# Altium schematic sheet micro.SchDoc
size A4
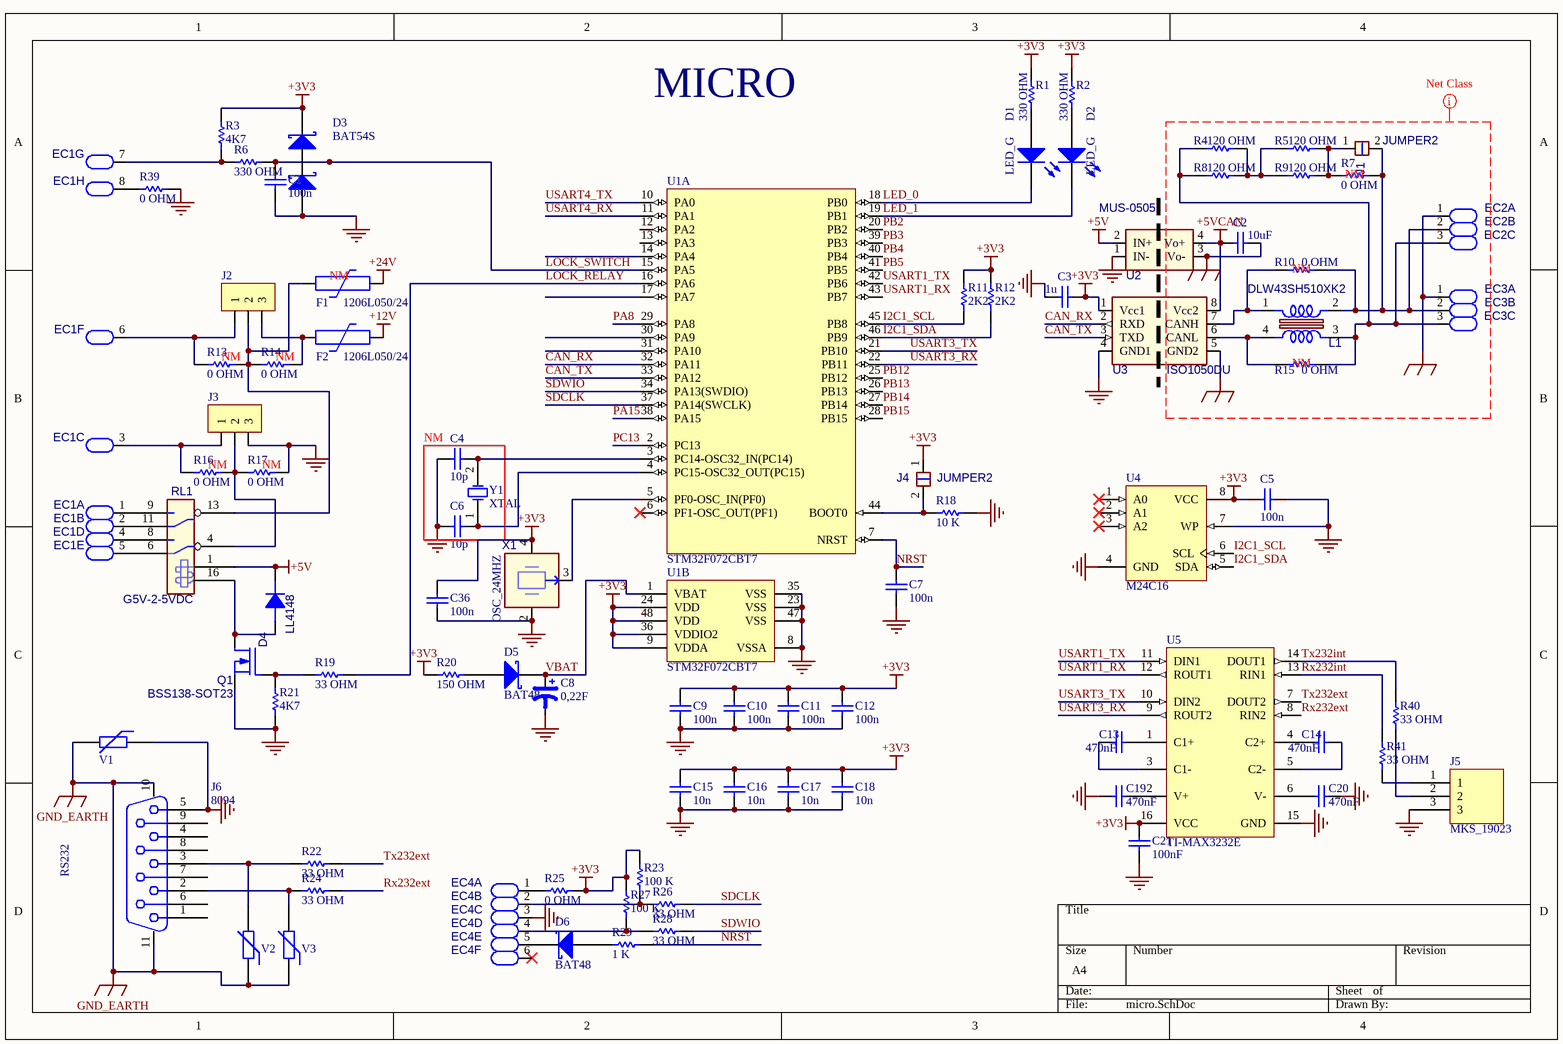
[diagram p0: micro.SchDoc]

## Parts
C1  100n  [0603]
C2  10uF  [0805]
C3  1u  [0603]
C4  10p  [0603]
C5  100n  [0603]
C6  10p  [0603]
C7  100n  [0603]
C8  0,22F  [EECRG0V224V]
C9  100n  [0603]
C10  100n  [0603]
C11  100n  [0603]
C12  100n  [0603]
C13  470nF  [0805]
C14  470nF  [0805]
C15  10n  [0603]
C16  10n  [0603]
C17  10n  [0603]
C18  10n  [0603]
C19  470nF  [0805]
C20  470nF  [0805]
C21  100nF  [0805]
C36  100n  [0603]
D1  LED_G  [LED0603G]
D2  LED_G  [LED0603G]
D3  BAT54S  [SOT23]
D4  LL4148  [SOD123]
D5  BAT48  [0805]
D6  BAT48  [0805]
EC1  JST_XAD_8  [JST_XADSS_8]  (value not drawn)  (parts A,B,C,D,E,F,G,H of 8)
EC2  Conexcon-2545-2-03-1_1  [CONEXCON-2545-2-03-1]  (value not drawn)  (parts A,B,C of 3)
EC3  Conexcon-2545-2-03-1_1  [CONEXCON-2545-2-03-1]  (value not drawn)  (parts A,B,C of 3)
EC4  Conexcon-2545-2-06-1  [CONEXCON-2545-2-06-1]  (value not drawn)  (parts A,B,C,D,E,F of 6)
F1  1206L050/24  [POLYFUSE_1206L]
F2  1206L050/24  [POLYFUSE_1206L]
J1  JUMPER2  [JUMPER_2X1_2.54]
J2  Header 3  [HDR1X3]  (value not drawn)
J3  Header 3  [HDR1X3]  (value not drawn)
J4  JUMPER2  [JUMPER_2X1_2.54]
J5  MKS_19023  [MOLEX_MKS_19023]
J6  8094  [8094]
L1  DLW43SH510XK2  [1812_DLW]
Q1  BSS138-SOT23  [SOT23 - RJ]
R1  330 OHM  [R0603]
R2  330 OHM  [R0603]
R3  4K7  [R0603]
R4  120 OHM  [R0603]
R5  120 OHM  [R0603]
R6  330 OHM  [R0603]
R7  0 OHM  [R0603]
R8  120 OHM  [R0603]
R9  120 OHM  [R0603]
R10  0 OHM  [R0603]
R11  2K2  [R0603]
R12  2K2  [R0603]
R13  0 OHM  [R0805]
R14  0 OHM  [R0805]
R15  0 OHM  [R0603]
R16  0 OHM  [R0805]
R17  0 OHM  [R0805]
R18  10 K  [R0603]
R19  33 OHM  [R0603]
R20  150 OHM  [R0603]
R21  4K7  [R0603]
R22  33 OHM  [R0603]
R23  100 K  [R0603]
R24  33 OHM  [R0603]
R25  0 OHM  [R0603]
R26  33 OHM  [R0603]
R27  100 K  [R0603]
R28  33 OHM  [R0603]
R29  1 K  [R0603]
R39  0 OHM  [R0603]
R40  33 OHM  [R0603]
R41  33 OHM  [R0603]
RL1  G5V-2-5VDC  [RL-OMRON-G5V-2-5VDC]
U1  STM32F072CBT7  [STM-LQFP48_N_3d]  (parts A,B of 2)
U2  MUS-0505  [MUS-0505]
U3  ISO1050DU  [DUB_R_PDSO_G8]
U4  M24C16  [SO08]
U5  TI-MAX3232E  [SOIC16]
V1  VC080526C580  [VC080526C580]  (value not drawn)
V2  VC080526C580  [VC080526C580]  (value not drawn)
V3  VC080526C580  [VC080526C580]  (value not drawn)
X1  OSC_24MHZ  [Oscillator_7x5]
Y1  XTAL  [R38]

## Blocks framed on the sheet
NM: C4 C6 Y1

## Nets
+3V3: C3.1 C5.2 C9.2 C10.2 C11.2 C12.2 C15.2 C16.2 C17.2 C18.2 C21.1 C36.2 D3.2(K) J4.1 R1.2 R2.2 R3.2 R11.1 R12.1 R20.1 R23.2 R25.1 R27.2 U1.9(VDDA) U1.24(VDD) U1.36(VDDIO2) U1.48(VDD) U3.1(Vcc1) U4.8(VCC) U5.16(VCC) X1.4
+5V: D4.2(K) RL1.1(COIL1) U2.2(IN+)
+5VCAN: C2.1 U2.4(Vo+) U3.8(Vcc2)
+12V: F2.2
+24V: F1.2
GND: C1.1 C3.2 C4.1 C5.1 C6.1 C7.1 C8.2 C9.1 C10.1 C11.1 C12.1 C15.1 C16.1 C17.1 C18.1 C19.1 C20.2 C21.2 C36.1 D3.1(A) EC4.3 J3.3 J5.3 J6.5 Q1.S R17.1 R18.1 R21.1 R39.1 U1.8(VSSA) U1.23(VSS) U1.35(VSS) U1.47(VSS) U2.1(IN-) U3.4(GND1) U4.4(GND) U4.7(WP) U5.15(GND) V1.1 X1.2
GND_CAN: C2.2 EC2.1 EC3.1 U2.3(Vo-) U3.5(GND2)
GND_EARTH: J6.10 J6.11 V1.2 V2.1 V3.1
CAN_RX: U1.32(PA11) U3.2(RXD)
CAN_TX: U1.33(PA12) U3.3(TXD)
I2C1_SCL: R11.2 U1.45(PB8) U4.6(SCL)
I2C1_SDA: R12.2 U1.46(PB9) U4.5(SDA)
LED_0: D1.2(K) U1.18(PB0)
LED_1: D2.2(K) U1.19(PB1)
LOCK_RELAY: R19.2 U1.16(PA6)
LOCK_SWITCH: C1.2 D3.3(KA) R6.1 U1.15(PA5)
NRST: C7.2 R29.2 U1.7(NRST)
PA8: U1.29(PA8)
PA15: U1.38(PA15)
PB2: U1.20(PB2)
PB3: U1.39(PB3)
PB4: U1.40(PB4)
PB5: U1.41(PB5)
PB12: U1.25(PB12)
PB13: U1.26(PB13)
PB14: U1.27(PB14)
PB15: U1.28(PB15)
PC13: U1.2(PC13)
Rx232ext: R24.2 U5.8(RIN2)
Rx232int: R41.2 U5.13(RIN1)
SDCLK: R26.2 U1.37(PA14(SWCLK))
SDWIO: R28.2 U1.34(PA13(SWDIO))
Tx232ext: R22.2 U5.7(DOUT2)
Tx232int: R40.2 U5.14(DOUT1)
USART1_RX: U1.43(PB7) U5.12(ROUT1)
USART1_TX: U1.42(PB6) U5.11(DIN1)
USART3_RX: U1.22(PB11) U5.9(ROUT2)
USART3_TX: U1.21(PB10) U5.10(DIN2)
USART4_RX: U1.11(PA1)
USART4_TX: U1.10(PA0)
VBAT: C8.1 D5.2(K) U1.1(VBAT)
NetC4_2: C4.2 U1.3(PC14-OSC32_IN(PC14)) Y1.2(OSC2)
NetC6_2: C6.2 U1.4(PC15-OSC32_OUT(PC15)) Y1.1(OSC1)
NetC13_1: C13.1 U5.3(C1-)
NetC13_2: C13.2 U5.1(C1+)
NetC14_1: C14.1 U5.4(C2+)
NetC14_2: C14.2 U5.5(C2-)
NetC19_2: C19.2 U5.2(V+)
NetC20_1: C20.1 U5.6(V-)
NetD1_1: D1.1(A) R1.1
NetD2_1: D2.1(A) R2.1
NetD4_1: D4.1(A) Q1.D RL1.16(COIL2)
NetD5_1: D5.1(A) R20.2
NetD6_1: D6.1(A) R29.1
NetD6_2: D6.2(K) EC4.5
NetEC1_1: EC1.1 RL1.9(NO)
NetEC1_2: EC1.2 RL1.11(NO)
NetEC1_3: EC1.3 J3.1 R16.2
NetEC1_4: EC1.4 RL1.8(NO)
NetEC1_5: EC1.5 RL1.6(NO)
NetEC1_6: EC1.6 J2.1 R13.2
NetEC1_7: EC1.7 R3.1 R6.2
NetEC1_8: EC1.8 R39.2
NetEC2_2: EC2.2 EC3.2 J1.2 L1.2 R7.2 R10.2
NetEC2_3: EC2.3 EC3.3 L1.3 R4.1 R8.1 R15.2
NetEC4_1: EC4.1 R25.2
NetEC4_2: EC4.2 R23.1 R26.1
NetEC4_4: EC4.4 R27.1 R28.1
NetF1_1: F1.1 J2.2 R13.1 R14.2 RL1.13(COMMON)
NetF2_1: F2.1 J2.3 R14.1
NetJ1_1: J1.1 R5.2 R7.1 R9.2
NetJ3_2: J3.2 R16.1 R17.2 RL1.4(COMMON)
NetJ4_2: J4.2 R18.2 U1.44(BOOT0)
NetJ5_1: J5.1 R41.1
NetJ5_2: J5.2 R40.1
NetJ6_2: J6.2 R24.1 V3.2
NetJ6_3: J6.3 R22.1 V2.2
NetL1_1: L1.1 R10.1 U3.7(CANH)
NetL1_4: L1.4 R15.1 U3.6(CANL)
NetQ1_G: Q1.G R19.1 R21.2
NetR4_2: R4.2 R5.1 R8.2 R9.1
NetU1_5: U1.5(PF0-OSC_IN(PF0)) X1.3

Not connected (* = marked no-connect by the designer): EC4 6*; J6 1 4 6 7 8 9; U1 6(PF1-OSC_OUT(PF1))* 12(PA2) 13(PA3) 14(PA4) 17(PA7) 30(PA9) 31(PA10); U4 1(A0)* 2(A1)* 3(A2)*

## Layout directives
net class EXT_CAN: +5VCAN, GND_CAN

## Notes on the sheet
- MICRO
- (near R7) NM
- (near F1) NM
- (near R10) NM
- (near R13) NM
- (near R14) NM
- (near R15) NM
- (near R16) NM
- (near R17) NM
- RS232

## Library data of the parts
C1 C5 C7 C9-C12 C36 = 6003071: Capacitor; Value: 100pF; DescripcionArticulo: COND. CERAMICO SMD 0603 100 NF X7R 50V 10%; tipo: condensador; Published: 8-Jun-2000; LatestRevisionDate: 17-Jul-2002; LatestRevisionNote: Re-released for DXP Platform.; PackageReference: RAD-0.3; Publisher: Altium Limited; PackageDescription: Radial Cap, Thru-Hole; 2 Leads; 0.3 in Pin Spacing; Codigo: 6003071; valor: 100n
C2 = 6003114: Capacitor; Value: 100pF; DescripcionArticulo: COND. CERAMICO SMD 0805 10 UF 6.3V -10V; tipo: condensador; Published: 8-Jun-2000; LatestRevisionDate: 17-Jul-2002; LatestRevisionNote: Re-released for DXP Platform.; PackageReference: RAD-0.3; Publisher: Altium Limited; PackageDescription: Radial Cap, Thru-Hole; 2 Leads; 0.3 in Pin Spacing; Codigo: 6003114; valor: 10uF
C3 = 6003088: Capacitor; Value: 100pF; DescripcionArticulo: COND. CERAMICO SMD 0603 1 UF X5R 10V 10%; tipo: condensador; Published: 8-Jun-2000; LatestRevisionDate: 17-Jul-2002; LatestRevisionNote: Re-released for DXP Platform.; PackageReference: RAD-0.3; Publisher: Altium Limited; PackageDescription: Radial Cap, Thru-Hole; 2 Leads; 0.3 in Pin Spacing; Codigo: 6003088; valor: 1u
C4 C6 = 6003068: Capacitor; Value: 100pF; DescripcionArticulo: COND. CERAMICO SMD 0603 10 PF X7R 50V; tipo: condensador; Published: 8-Jun-2000; LatestRevisionDate: 17-Jul-2002; LatestRevisionNote: Re-released for DXP Platform.; PackageReference: RAD-0.3; Publisher: Altium Limited; PackageDescription: Radial Cap, Thru-Hole; 2 Leads; 0.3 in Pin Spacing; Codigo: 6003068; valor: 10p
C8 = 3023047: Polarized Capacitor (Axial); DescripcionArticulo: CONDENSADOR EECS0HD224V 0,22F 5,5 V; tipo: condensador; Published: 8-Jun-2000; LatestRevisionDate: 17-Jul-2002; LatestRevisionNote: Re-released for DXP Platform.; PackageReference: POLAR0.8; Publisher: Altium Limited; PackageDescription: Polarized Capacitor; 2 Leads; Codigo: 3023047; valor: 0,22F
C13 C14 C19 C20 = 6003055: Capacitor; Value: 100pF; DescripcionArticulo: COND. CERAMICO SMD 0805 470NF X7R 50V 10%; tipo: condensador; Published: 8-Jun-2000; LatestRevisionDate: 17-Jul-2002; LatestRevisionNote: Re-released for DXP Platform.; PackageReference: RAD-0.3; Publisher: Altium Limited; PackageDescription: Radial Cap, Thru-Hole; 2 Leads; 0.3 in Pin Spacing; Codigo: 6003055; valor: 470nF
C15-C18 = 6003067: Capacitor; Value: 100pF; DescripcionArticulo: COND. CERAMICO SMD 0603 10 NF X7R 50V 10%; tipo: condensador; Published: 8-Jun-2000; LatestRevisionDate: 17-Jul-2002; LatestRevisionNote: Re-released for DXP Platform.; PackageReference: RAD-0.3; Publisher: Altium Limited; PackageDescription: Radial Cap, Thru-Hole; 2 Leads; 0.3 in Pin Spacing; Codigo: 6003067; valor: 10n
C21 = 6003010: Capacitor; Value: 100pF; DescripcionArticulo: COND. CERAMICO SMD 0805 100 NF 50V 10%; tipo: condensador; Published: 8-Jun-2000; LatestRevisionDate: 17-Jul-2002; LatestRevisionNote: Re-released for DXP Platform.; PackageReference: RAD-0.3; Publisher: Altium Limited; PackageDescription: Radial Cap, Thru-Hole; 2 Leads; 0.3 in Pin Spacing; Codigo: 6003010; valor: 100nF
D1 D2 = 6006022: Typical RED, GREEN, YELLOW, AMBER GaAs LED; DescripcionArticulo: DIODO LED VERDE SML-LX0603GW 1.6X0.8X0.6; Escandallo: Sí; tipo: diodo; Published: 8-Jun-2000; LatestRevisionDate: 17-Jul-2002; LatestRevisionNote: Re-released for DXP Platform.; PackageVersion: Feb-2002; PackageReference: 3.2X1.6X1.1; Publisher: Altium Limited; PackageDescription: SM LED; 2 Flat Leads; Codigo: 6006022; valor: LED_G
D3 = 6006051: High Current Density Surface Mount Schottky Rectifier; DescripcionArticulo: DIODO SMD BAT54S Schottky 30V,200mA VISHAY; Escandallo: Sí; tipo: diodo; Codigo: 6006051; valor: BAT54S
D4 = LL4148_(06006001): DIODE SWITCH,100V,150MA,SOD123; Sallen Ref: 06006001; Codigo: 06006001
D5 D6 = 6006002: Schottky Diode; DescripcionArticulo: DIODO SMD TMMBAT48 SCHORTKY; Escandallo: Sí; tipo: diodo; Published: 8-Jun-2000; LatestRevisionDate: 17-Jul-2002; LatestRevisionNote: Re-released for DXP Platform.; PackageReference: SMB; Publisher: Altium Limited; PackageDescription: DO-214-AA/SMB; 2 C-Bend Leads; Body 5.3 x 3.6 mm, inc. leads (LxW); Code_JEDEC: DO-214-AA; Codigo: 6006002; valor: BAT48
EC1 = Conn_JST_XADSS_8_vias: Conector 8(2x4) vias (3A); Sallen Ref: 05100217; Part Number: -
EC2 EC3 = 5100106: 2.54mm pitch Terminal Block 3P; Sallen Ref: 05100106; DescripcionArticulo: CON.RECTO MACHO 3P SERIE 2545 PASO 2.54; Escandallo: Sí; valor: RECTO3P; tipo: conector; Part Number: Conexcon-2545-2-03-1; Codigo: 5100106
EC4 = 5100107: 2.54mm pitch Terminal Block 6P; Sallen Ref: 05100107; DescripcionArticulo: CON.RECTO MACHO 6P SERIE 2545 PASO 2.54; Escandallo: Sí; valor: RECTO6P; tipo: conector; Part Number: Conexcon-2545-2-06-1; Codigo: 5100107
F1 F2 = POLYFUSE_1206L050/24: www.digikey.com: 507-1803-1-ND
J1 J4 = 5190140: Jumper 2pin P=2.54mm; Sallen Ref: 05190140; DescripcionArticulo: JUMPER PARA POSTE AISLADO- PASO: 2.54MM (CO 3005); Escandallo: Sí; valor: JMP; tipo: conector; Part Number: -; Codigo: 5190140
J2 J3 = 5190120: Header, 3-Pin; DescripcionArticulo: BARRA TIRA POSTE C.I M+M 1X3 RECTA paso 2.54mm; Descripcion2Articulo: Pin Strip Header 1x3; Escandallo: Sí; LatestRevisionDate: 17-Jul-2002; LatestRevisionNote: Re-released for DXP Platform.; Publisher: Altium Limited; Codigo: 5190120
J5 = 5100079: Molex_MKS_19023; Sallen Ref: 05100079; DescripcionArticulo: CONEC.MACHO 3P STOCKO MKS19023; Escandallo: Sí; Codigo: 5100079; valor: MOLEX_MKS_19023
L1 = 6012027: Bobina Common mode 51uH 230mA 1.0Ohm SMD 1812 /Murata; Sallen Ref: 06012027; DescripcionArticulo: DLW43SH510XK2L SMD Common Mode Choke 1812; Descripcion2Articulo: DLW43SH510XK2L MURATA; Escandallo: Sí; valor: DLW43SH510XK2L; Mfg2: Murata; Mfg1_PN: DLW43SH510XK2; Codigo: 6012027; tipo: bobina
Q1 = BSS138-SOT23: N-Channel Logic Level Enhancement Mode Field Effect Transistor; Sallen Ref: 06004021; Part Number: BSS138-SOT23; Codigo: 06004021
R1 R2 R6 = 6005080: Resistor; Value: 1K; DescripcionArticulo: RESISTENCIA SMD 0603 330 OHM, 1% 0.1W; tipo: resistencia; Published: 8-Jun-2000; LatestRevisionDate: 17-Jul-2002; LatestRevisionNote: Re-released for DXP Platform.; PackageReference: AXIAL-0.3; Publisher: Altium Limited; PackageDescription: Axial Device, Thru-Hole; 2 Leads; 0.3 in Pin Spacing; Codigo: 6005080; valor: 330 OHM
R3 R21 = 6005096: Resistor; Value: 1K; DescripcionArticulo: RESISTENCIA SMD 0603 4K7, 1% 0.1W; tipo: resistencia; Published: 8-Jun-2000; LatestRevisionDate: 17-Jul-2002; LatestRevisionNote: Re-released for DXP Platform.; PackageReference: AXIAL-0.3; Publisher: Altium Limited; PackageDescription: Axial Device, Thru-Hole; 2 Leads; 0.3 in Pin Spacing; Codigo: 6005096; valor: 4K7
R4 R5 R8 R9 = 6005086: Resistor; Value: 1K; DescripcionArticulo: RESISTENCIA SMD 0603 120 OHM, 1% 0.1W; tipo: resistencia; Published: 8-Jun-2000; LatestRevisionDate: 17-Jul-2002; LatestRevisionNote: Re-released for DXP Platform.; PackageReference: AXIAL-0.3; Publisher: Altium Limited; PackageDescription: Axial Device, Thru-Hole; 2 Leads; 0.3 in Pin Spacing; Codigo: 6005086; valor: 120 OHM
R7 R10 R15 R25 R39 = 6005124: Resistor; Value: 1K; DescripcionArticulo: RESISTENCIA SMD 0603 0 OHM, 1% 0.1W; tipo: resistencia; Published: 8-Jun-2000; LatestRevisionDate: 17-Jul-2002; LatestRevisionNote: Re-released for DXP Platform.; PackageReference: AXIAL-0.3; Publisher: Altium Limited; PackageDescription: Axial Device, Thru-Hole; 2 Leads; 0.3 in Pin Spacing; Codigo: 6005124; valor: 0 OHM
R11 R12 = 6005073: Resistor; Value: 1K; DescripcionArticulo: RESISTENCIA SMD 0603 2K2, 1% 0.1W; tipo: resistencia; Published: 8-Jun-2000; LatestRevisionDate: 17-Jul-2002; LatestRevisionNote: Re-released for DXP Platform.; PackageReference: AXIAL-0.3; Publisher: Altium Limited; PackageDescription: Axial Device, Thru-Hole; 2 Leads; 0.3 in Pin Spacing; Codigo: 6005073; valor: 2K2
R13 R14 R16 R17 = 6005227: Resistor; Value: 1K; DescripcionArticulo: RESISTENCIA SMD 0805 0 OHM, 1% 0.1W; tipo: resistencia; Published: 8-Jun-2000; LatestRevisionDate: 17-Jul-2002; LatestRevisionNote: Re-released for DXP Platform.; PackageReference: AXIAL-0.3; Publisher: Altium Limited; PackageDescription: Axial Device, Thru-Hole; 2 Leads; 0.3 in Pin Spacing; Codigo: 6005227; valor: 0 OHM
R18 = 6005102: Resistor; Value: 1K; DescripcionArticulo: RESISTENCIA SMD 0603 10 K, 1%; tipo: resistencia; Published: 8-Jun-2000; LatestRevisionDate: 17-Jul-2002; LatestRevisionNote: Re-released for DXP Platform.; PackageReference: AXIAL-0.3; Publisher: Altium Limited; PackageDescription: Axial Device, Thru-Hole; 2 Leads; 0.3 in Pin Spacing; Codigo: 6005102; valor: 10 K
R19 R22 R24 R26 R28 R40 R41 = 6005074: Resistor; Value: 1K; DescripcionArticulo: RESISTENCIA SMD 0603 33 OHM, 1% 0.1W; tipo: resistencia; Published: 8-Jun-2000; LatestRevisionDate: 17-Jul-2002; LatestRevisionNote: Re-released for DXP Platform.; PackageReference: AXIAL-0.3; Publisher: Altium Limited; PackageDescription: Axial Device, Thru-Hole; 2 Leads; 0.3 in Pin Spacing; Codigo: 6005074; valor: 33 OHM
R20 = 6005087: Resistor; Value: 1K; DescripcionArticulo: RESISTENCIA SMD 0603 150 OHM, 1% 0.1W; tipo: resistencia; Published: 8-Jun-2000; LatestRevisionDate: 17-Jul-2002; LatestRevisionNote: Re-released for DXP Platform.; PackageReference: AXIAL-0.3; Publisher: Altium Limited; PackageDescription: Axial Device, Thru-Hole; 2 Leads; 0.3 in Pin Spacing; Codigo: 6005087; valor: 150 OHM
R23 R27 = 6005075: Resistor; Value: 1K; DescripcionArticulo: RESISTENCIA SMD 0603 100 K, 1%; tipo: resistencia; Published: 8-Jun-2000; LatestRevisionDate: 17-Jul-2002; LatestRevisionNote: Re-released for DXP Platform.; PackageReference: AXIAL-0.3; Publisher: Altium Limited; PackageDescription: Axial Device, Thru-Hole; 2 Leads; 0.3 in Pin Spacing; Codigo: 6005075; valor: 100 K
R29 = 6005111: Resistor; Value: 1K; DescripcionArticulo: RESISTENCIA SMD 0603 1 K, 1% 0.1W; tipo: resistencia; Published: 8-Jun-2000; LatestRevisionDate: 17-Jul-2002; LatestRevisionNote: Re-released for DXP Platform.; PackageReference: AXIAL-0.3; Publisher: Altium Limited; PackageDescription: Axial Device, Thru-Hole; 2 Leads; 0.3 in Pin Spacing; Codigo: 6005111; valor: 1 K
RL1 = G5V-2-5VDC: Omrom Relay G5V-2-5VDC; Sallen Ref: 05032015; Codigo: 05032015
U1 = 4021038: DescripcionArticulo: MICRO STM32F072CBT7 LQFP48; Escandallo: Sí; tipo: integrado; Codigo: 4021038; valor: STM32F072CBT7
U2 = 4007001: Convertidor DC/DC isolated 1W 5v/5v 1.8E DANUBE (eQ XpPower IE0505S); Sallen Ref: 04007002; DescripcionArticulo: CONVERTIDOR DC/DC 1W 5V/12V 1.8 MUS-0512; Escandallo: Sí; tipo: integrado; Part Number: -; Codigo: 4007001; valor: MUS-0505
U3 = 6001176: CAN Transceiver Isolated 3-5vcc (-55º-105ºC)SOP8-DIP; Sallen Ref: 06001176; DescripcionArticulo: CAN TRANSCEIVER ISO1050DU SOP8-DIP; Escandallo: Sí; tipo: integrado; Part Number: -; Codigo: 6001176; valor: ISO1050DU
U4 = 6001076: DescripcionArticulo: CIRCUITO INTEGRADO SMD M24C16 WMN6TP SOIC8P; Escandallo: Sí; Codigo: 6001076; valor: M24C16
U5 = 6001091: DescripcionArticulo: CIRCUITO INTEGRADO SMD MAX3232CSE; Escandallo: Sí; tipo: integrado; Codigo: 6001091; valor: MAX3232
V1-V3 = VC080526C580: Varistor (Voltage-Sensitive Resistor); www.digikey.com: 478-2514-6-ND
X1 = OSC7X5_4P3.3-24MHZ: Oscillator 7x5mm 24Mhz 3.3v 4p s73305T-24 //Aker-usa; Sallen Ref: 04027021; Part Number: -; Part Type: Oscillator; Codigo: 04027021
Y1 = XTAL: Crystal Oscillator; Published: 8-Jun-2000; LatestRevisionDate: 17-Jul-2002; LatestRevisionNote: Re-released for DXP Platform.; PackageReference: R38; Publisher: Altium Limited; PackageDescription: Crystal, Thru-Hole; 2 Leads; Body 3.1 x 8.2 mm (Dia.xH)